# Altium schematic sheet Télécommande.SchDoc
size A4
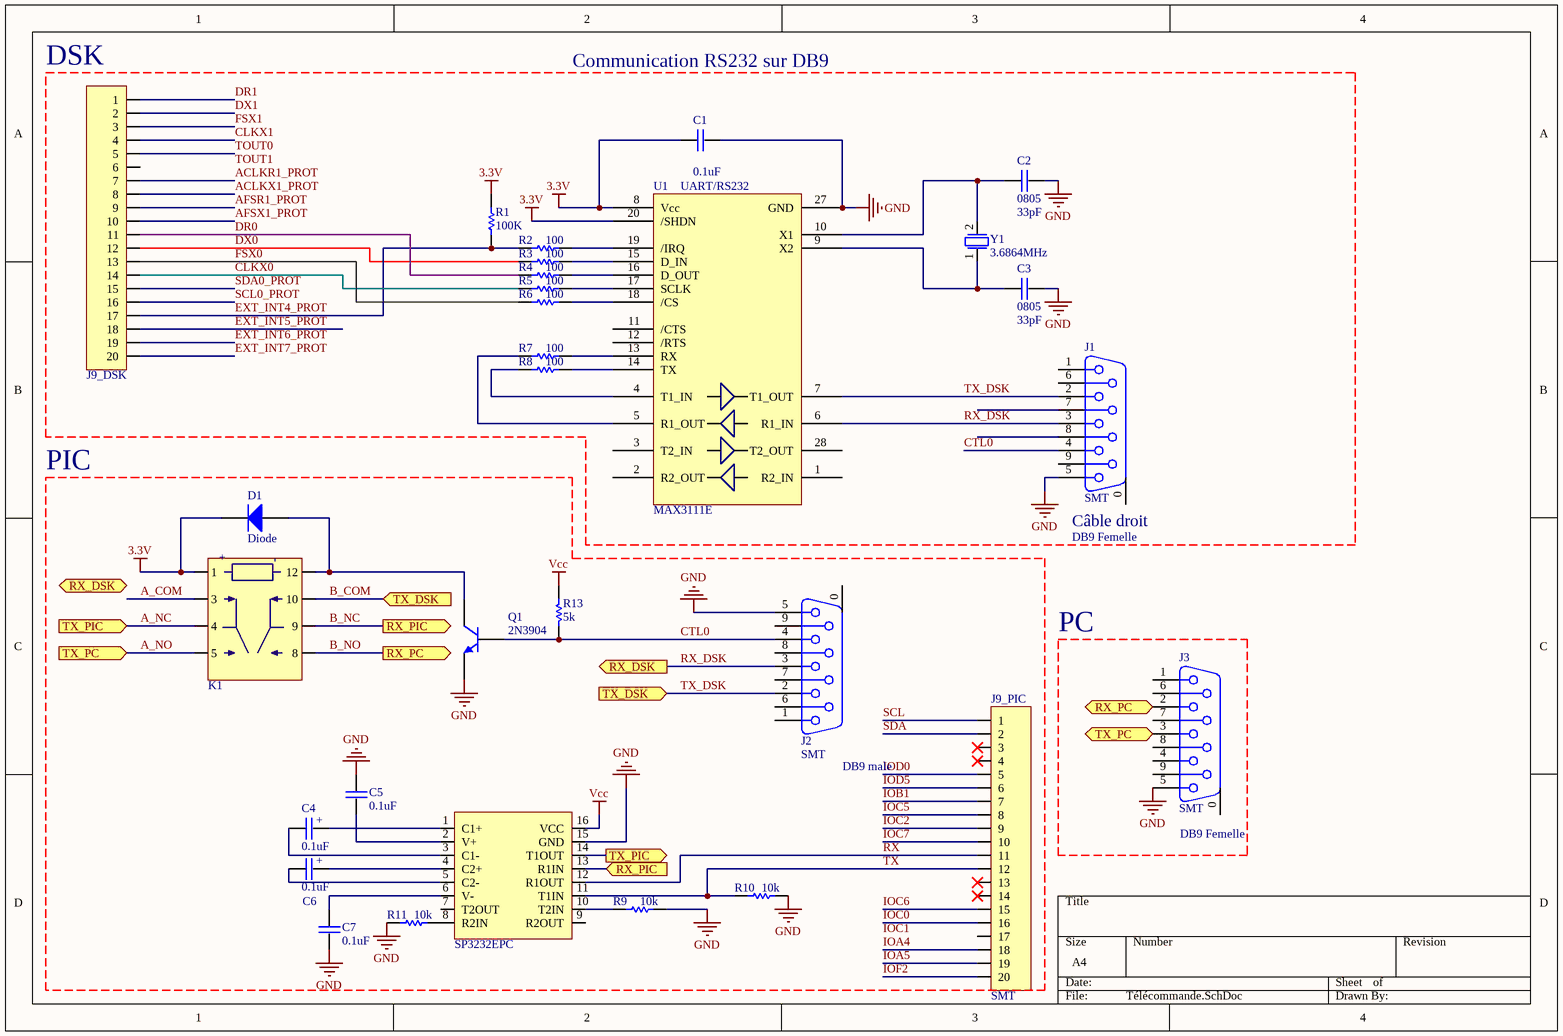
[diagram p0: Télécommande.SchDoc]

## Parts
C1  value 0.1uF  [0805]  (hidden comment: Cap 0.1uF)
C2  value 33pF  [0805]  (hidden comment: Cap 39pF)
C3  value 33pF  [0805]  (hidden comment: Cap 39pF)
C4  value 0.1uF  [0805]  (hidden comment: Cap 0.1uF)
C5  value 0.1uF  [0805]  (hidden comment: Cap 0.1uF)
C6  value 0.1uF  [0805]  (hidden comment: Cap 0.1uF)
C7  value 0.1uF  [0805]  (hidden comment: Cap 0.1uF)
D1  Diode  [SMC]
J1  Package: SMT  [DB9 connector - SMT]  (hidden comment: Conn DB9)
J2  Package: SMT  [DB9 connector - SMT]  (hidden comment: Conn DB9)
J3  Package: SMT  [DB9 connector - SMT]  (hidden comment: Conn DB9)
J9_DSK  Conn20pinsF  [Conn_20_SMT]  (value not drawn)
J9_PIC  Package: SMT  [Conn_20_SMT]  (hidden comment: Conn20pinsF)
K1  Relay 3V  [Relay_3V]  (value not drawn)
Q1  2N3904  [TO-92A]
R1  value 100K  [0805]  (hidden comment: Res100k_1%)
R2  value 100  [0805]  (hidden comment: Res100_1%)
R3  value 100  [0805]  (hidden comment: Res100_1%)
R4  value 100  [0805]  (hidden comment: Res100_1%)
R5  value 100  [0805]  (hidden comment: Res100_1%)
R6  value 100  [0805]  (hidden comment: Res100_1%)
R7  value 100  [0805]  (hidden comment: Res100_1%)
R8  value 100  [0805]  (hidden comment: Res100_1%)
R9  value 10k  [0805]  (hidden comment: Res100_1%)
R10  value 10k  [0805]  (hidden comment: Res100_1%)
R11  value 10k  [0805]  (hidden comment: Res100_1%)
R13  value 5k  [0805]  (hidden comment: Res100k_1%)
SP3232EPC  SP3232EPC  [board-2-board40p_M]  (value not drawn)
U1  MAX3111E  [SOIC-28]
Y1  value 3.6864MHz  [Cristal HC49/US]  (hidden comment: Load Cap = 20pF, 200Ohm (ESR))

## Ports
RX_DSK (out), RX_PC (in), RX_PC (out), RX_PIC (in), RX_PIC (out), TX_DSK (in), TX_PC (in), TX_PC (out), TX_PIC (in), TX_PIC (out)

## Nets
3.3V: C1.2 D1.2(K) K1.1 R1.2 U1.8(Vcc) U1.20(/SHDN)
GND: C1.1 C2.2 C3.2 C5.2 C7.2 J1.5 J2.5 J3.5 Q1.1(E) R9.2 R10.2 R11.1 SP3232EPC.15(GND) U1.27(GND)
Vcc: R13.2 SP3232EPC.16(VCC)
A_COM: K1.3
A_NC: K1.4 SP3232EPC.14(T1OUT) ; port TX_PIC
A_NO: J3.3 K1.5 ; port TX_PC
ACLKR1_PROT: J9_DSK.7
ACLKX1_PROT: J9_DSK.8
AFSR1_PROT: J9_DSK.9
AFSX1_PROT: J9_DSK.10
B_COM: J1.2 J2.2 K1.10 U1.7(T1_OUT) ; port TX_DSK  [also labelled TX_DSK]
B_NC: K1.9 SP3232EPC.13(R1IN) ; port RX_PIC
B_NO: J3.2 K1.8 ; port RX_PC
CLKX0: J9_DSK.14 R5.1
CLKX1: J9_DSK.4
CTL0: J1.4 J2.4 Q1.2(B) R13.1
DR0: J9_DSK.11 R4.1
DR1: J9_DSK.1
DX0: J9_DSK.12 R3.1
DX1: J9_DSK.2
EXT_INT4_PROT: J9_DSK.17 R1.1 R2.1
EXT_INT5_PROT: J9_DSK.18
EXT_INT6_PROT: J9_DSK.19
EXT_INT7_PROT: J9_DSK.20
FSX0: J9_DSK.13 R6.1
FSX1: J9_DSK.3
IOA4: J9_PIC.18
IOA5: J9_PIC.19
IOB1: J9_PIC.7
IOC0: J9_PIC.16
IOC2: J9_PIC.9
IOC5: J9_PIC.8
IOC6: J9_PIC.15
IOC7: J9_PIC.10
IOD0: J9_PIC.5
IOD5: J9_PIC.6
IOF2: J9_PIC.20
RX: J9_PIC.11 SP3232EPC.12(R1OUT)
RX_DSK: J1.3 J2.3 U1.6(R1_IN) ; port RX_DSK
SCL: J9_PIC.1
SCL0_PROT: J9_DSK.16
SDA: J9_PIC.2
SDA0_PROT: J9_DSK.15
TOUT0: J9_DSK.5
TX: J9_PIC.12 R10.1 SP3232EPC.11(T1IN)
NetC2_1: C2.1 U1.10(X1) Y1.2
NetC3_1: C3.1 U1.9(X2) Y1.1
NetC4_1: C4.1 SP3232EPC.3(C1-)
NetC4_2: C4.2 SP3232EPC.1(C1+)
NetC5_1: C5.1 SP3232EPC.2(V+)
NetC6_1: C6.1 SP3232EPC.5(C2-)
NetC6_2: C6.2 SP3232EPC.4(C2+)
NetC7_1: C7.1 SP3232EPC.6(V-)
NetD1_1: D1.1(A) K1.12 Q1.3(C)
NetR2_2: R2.2 U1.19(/IRQ)
NetR3_2: R3.2 U1.15(D_IN)
NetR4_2: R4.2 U1.16(D_OUT)
NetR5_2: R5.2 U1.17(SCLK)
NetR6_2: R6.2 U1.18(/CS)
NetR7_1: R7.1 U1.5(R1_OUT)
NetR7_2: R7.2 U1.13(RX)
NetR8_1: R8.1 U1.4(T1_IN)
NetR8_2: R8.2 U1.14(TX)
NetR9_1: R9.1 SP3232EPC.10(T2IN)
NetR11_2: R11.2 SP3232EPC.8(R2IN)

Not connected (* = marked no-connect by the designer): J1 0 1 6 7 8 9; J2 0 1 6 7 8 9; J3 0 1 4 6 7 8 9; J9_DSK 6; J9_PIC 3* 4* 13* 14* 17; SP3232EPC 7(T2OUT) 9(R2OUT); U1 1(R2_IN) 2(R2_OUT) 3(T2_IN) 11(/CTS) 12(/RTS) 21(V+) 22(C1+) 23(C1-) 24(C2+) 25(C2-) 26(V-) 28(T2_OUT)

## Notes on the sheet
- (near J9_DSK) DSK
- Communication RS232 sur DB9
- (near U1) UART/RS232
- PIC
- DB9 Femelle
- (near J1) Câble droit
- PC
- (near J2) DB9 male
- (near C4) +
- (near J3) DB9 Femelle
- (near C6) +
- Labels drawn without touching a wire or pin: IOC1, TOUT1
- (in symbol Relay 3V) +; -

## Library data of the parts
C1 C4-C7 = Cap 0.1uF: Condensateur céramique 0.1uF; Manufacturer: Samsung Electro-Mechanics America, Inc.; Mfg Part Number: CL21B104KBCNNNC; Precision: 10%; Current: *; Power: *; HelpURL: http://www.samsungsem.com/kr/support/product-search/mlcc/__icsFiles/afieldfile/2016/08/18/S_CL21B104KBCNNNC.pdf; CreatedBy: Mathieu G-M; VerifiedBy: *; FootprintNameOk: *; NI: *; Supplier 1: Digi-Key; Supplier Part Number 1: 1276-1003-1-ND; Package: 0805
C2 C3 = Cap 39pF: Condensateur céramique 39pF; Manufacturer: Samsung Electro-Mechanics America, Inc.; Mfg Part Number: CL21C390JBANNNC; Precision: 5%; Voltage: 50V; Current: *; Power: *; HelpURL: http://www.samsungsem.com/kr/support/product-search/mlcc/__icsFiles/afieldfile/2016/08/18/S_CL05C390JB5NNNC.pdf; CreatedBy: Chloe Mireault-Lecourt; VerifiedBy: Olivier Bernard; FootprintNameOk: *; NI: *; Supplier 1: Digi-Key; Supplier Part Number 1: 1276-1769-1-ND; Package: 0805
D1 = Diode: Default Diode; Published: 8-Jun-2000; LatestRevisionDate: 17-Jul-2002; LatestRevisionNote: Re-released for DXP Platform.; PackageVersion: Sep-1996; PackageReference: SMC; Publisher: Altium Limited; PackageDescription: DO-214-AB/SMC; 2 C-Bend Leads; Body 7.9 x 5.9 mm, inc. leads (LxW); Code_JEDEC: DO-214-AB
J1-J3 = Conn DB9: DB9 connecteur femelle; Manufacturer: Amphenol Commercial Products; Mfg Part Number: L17SM209SB64T; Voltage: 300V; Current: 3A; Precision: *; HelpURL: https://www.amphenolcanada.com/ProductSearch/pdf/L17SM2_BRO.pdf; CreatedBy: Mathieu G-M; VerifiedBy: *; FootprintNameOk: *; Value: *; NI: *; Supplier 1: Digi-Key; Supplier Part Number 1: L17SM209SB64T-ND
J9_DSK J9_PIC = Conn20pinsF: Connecteur 20 pins F - pitch = 100mils; Manufacturer: Sullins Connector Solutions; Mfg Part Number: NPTC102KFMS-RC; Precision: *; Voltage: *; Current: *; Power: *; HelpURL: https://media.digikey.com/pdf/Data%20Sheets/Sullins%20PDFs/NPxCxx2KFMx-RC%2010488-D.pdf; CreatedBy: Olivier Bernard; VerifiedBy: *; FootprintNameOk: *; Value: 100 mils; NI: *; Supplier 1: Digi-Key; Supplier Part Number 1: S5680-ND
  J9_DSK: Package: SMT
K1 = Relay 3V: Manufacturer: Panasonic Electric Works; Mfg Part Number: TXS2SA-3V; Voltage: Turn ON (2.4V), Turn OFF (0.3V); Current: 16.7mA (max rated 1A); Power: coil Power (50mW); Value: 180 Ohms (coil Resistance); Precision: *; HelpURL: http://www3.panasonic.biz/ac/e_download/control/relay/signal/catalog/mech_eng_txs.pdf; CreatedBy: Chloe Mireault-Lecourt; VerifiedBy: Olivier Bernard; FootprintNameOk: *; NI: *; Supplier 1: Digi-Key; Package: SMT, Gull Wing; Supplier Part Number 1: 255-2341-5-ND
Q1 = 2N3904: NPN General Purpose Amplifier; Published: 8-Jun-2000; LatestRevisionDate: 15-Jan-2003; LatestRevisionNote: PCB Footprint 'BCY-W3/D4.7' replaced; DatasheetVersion: 1997; PackageVersion: Sep-1998; PackageReference: TO-92A; Publisher: Altium Limited; PackageDescription: TO, Flat Index; 3 In-Line, Axial Leads; Body Dia. 4.5mm; Leads 0.51 x 0.48 mm (max); ComponentLink1Description: Manufacturer Link; ComponentLink1URL: http://www.fairchildsemi.com/; ComponentLink2Description: Datasheet; ComponentLink2URL: http://www.fairchildsemi.com/ds/2N%2F2N3904.pdf
R1 R13 = Res100k_1%: Res 100k - SMT - 0805; Manufacturer: Yageo; Mfg Part Number: RC0805FR-07100KL; Precision: 1%; Power: 1/8W; Voltage: *; Current: *; HelpURL: http://www.yageo.com.tw/exep/pages/download/literatures/PYu-R_INT-thick_7.pdf; CreatedBy: Olivier Bernard; VerifiedBy: *; FootprintNameOk: *; NI: *; Supplier 1: Digi-Key; Supplier Part Number 1: 311-100KCRCT-ND; Package: 0805
R2-R11 = Res100_1%: Res 100- SMT - 0805; Manufacturer: Yageo; Mfg Part Number: RC0805FR-07100RL; Precision: 1%; Power: 1/8W; Voltage: *; Current: *; HelpURL: http://www.yageo.com.tw/exep/pages/download/literatures/PYu-R_INT-thick_7.pdf; CreatedBy: Olivier Bernard; VerifiedBy: *; FootprintNameOk: *; NI: *; Supplier 1: Digi-Key; Supplier Part Number 1: 311-100CRCT-ND; Package: 0805
SP3232EPC = SP3232EPC: 40 Position Connector Header, Outer Shroud Contacts Surface Mount, Right Angle Gold; Manufacturer: Hirose Electric Co Ltd; Mfg Part Number: FX18-40P-0.8SH; Precision: pitch = 0.031"; Voltage: *; Current: *; Power: *; HelpURL: file:///C:/Users/Olivier/Downloads/FX18_05790002500_2d.pdf; CreatedBy: BJong; VerifiedBy: Olivier Bernard; FootprintNameOk: *; Value: *; NI: *; Supplier 1: Digi-Key; Supplier Part Number 1: H11868-ND
U1 = MAX3111E: SPI/MICROWIRE Compatible UART and RS-232 Transceiver; Manufacturer: Maxim Integrated; Mfg Part Number: MAX3111ECWI+G36; Current: 600µA (supply); Voltage - Supply: 3 V ~ 3.6 V; Value: RS232, RS485, SPI, UART; Precision: *; Power: *; CreatedBy: Chloe Mireault-Lecourt; FootprintNameOk: *; NI: *; Package: 28-SOIC; HelpURL: https://datasheets.maximintegrated.com/en/ds/MAX3110E-MAX3111E.pdf; Supplier 1: Digi-Key; Supplier Part Number 1: MAX3111ECWI+G36-ND; VerifiedBy: Olivier Bernard
Y1 = Crystal_3.6864: Crystal 3.6864MHz - SMT - HC49/US; Manufacturer: Fox Electronics; Mfg Part Number: FOXSDLF/0368-20; Current: *; HelpURL: http://www.foxonline.com/pdfs/hc49sdlf.pdf; CreatedBy: Chloe Mireault-Lecourt; VerifiedBy: Olivier Bernard; FootprintNameOk: *; NI: *; Supplier 1: Digi-Key; Package: HC49/US; Supplier Part Number 1: 631-1004-1-ND